# EAGLE design LB_BIT_i22_sequencer-v03(rev2_3) (EAGLE 6.6.0)
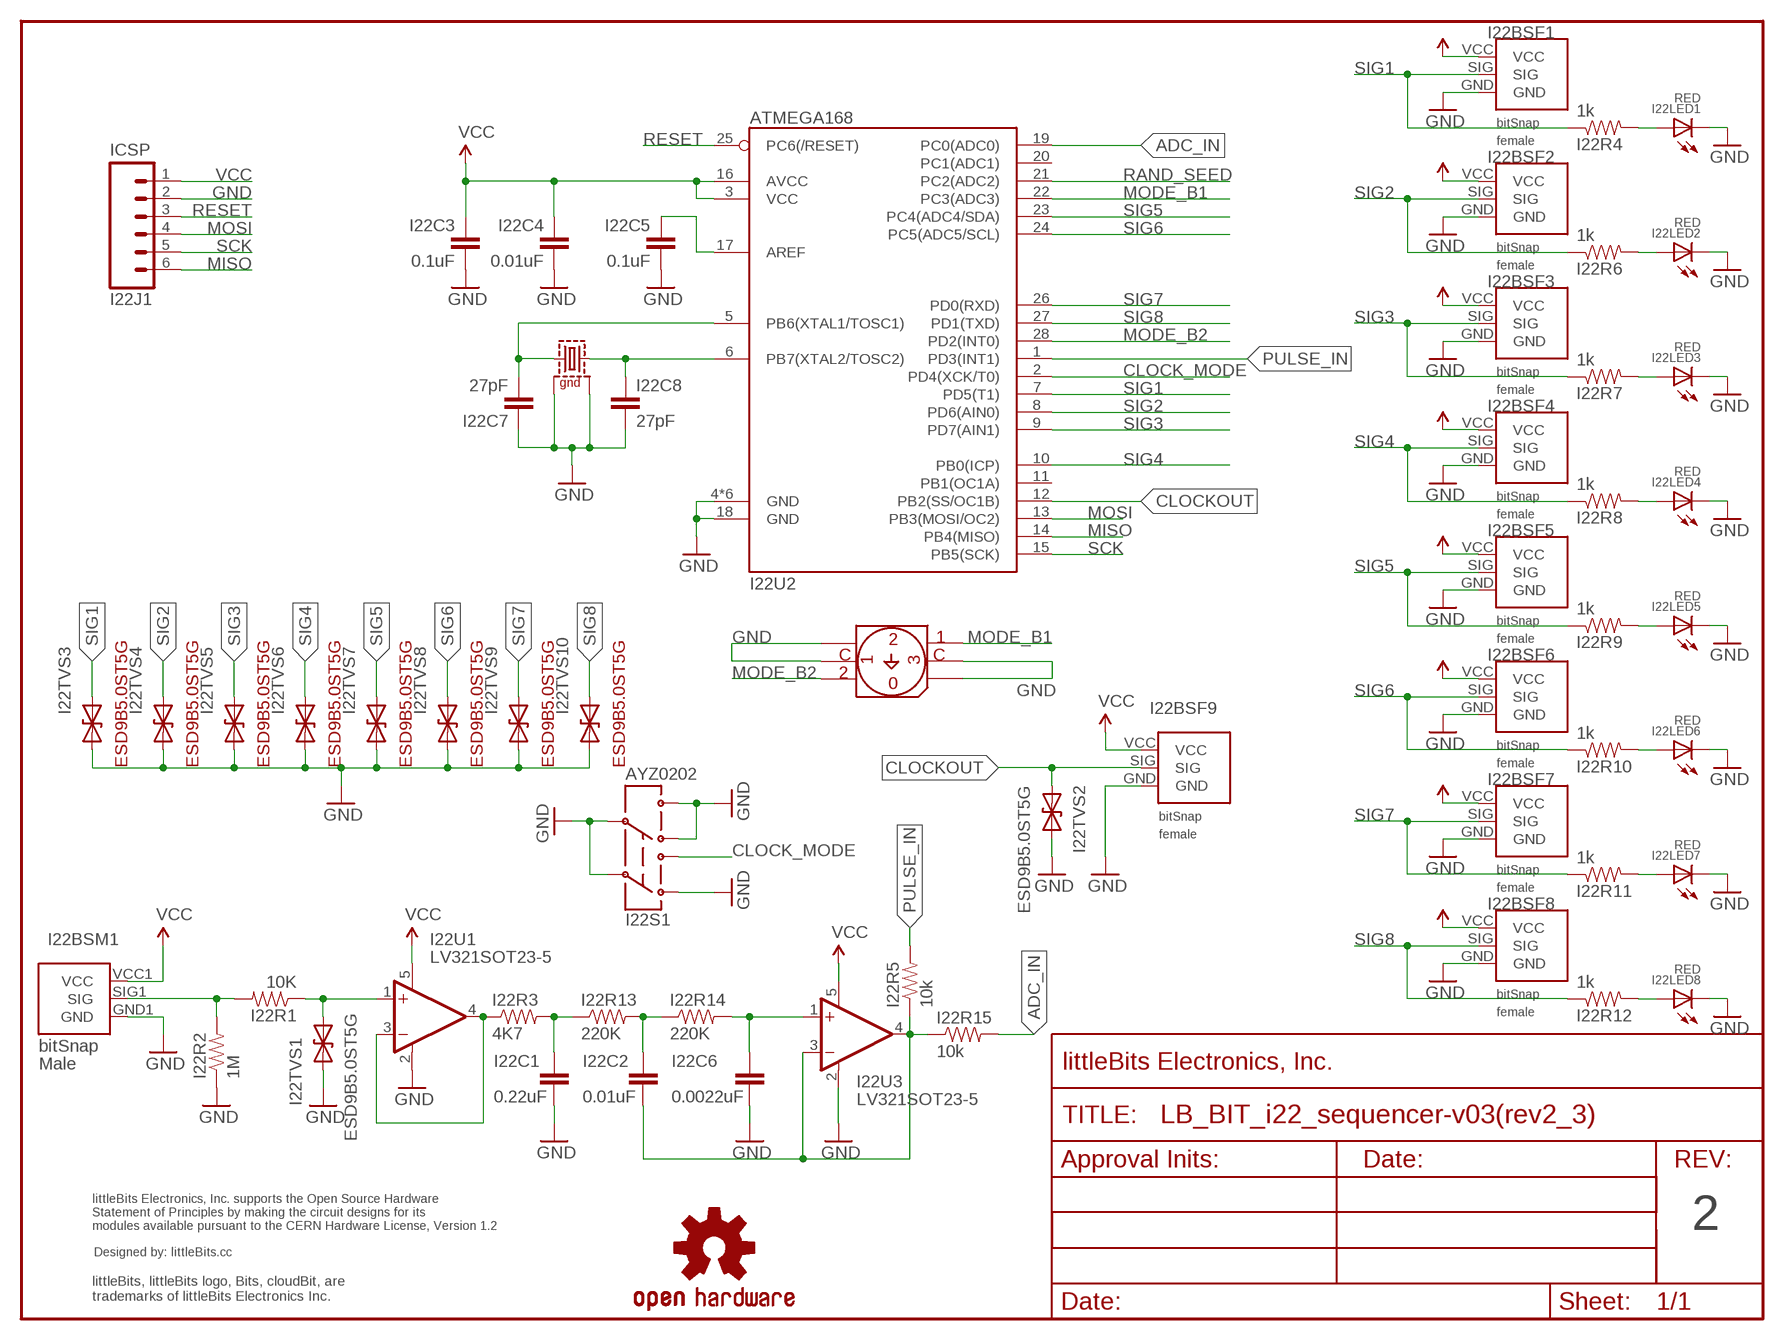
[diagram p0: schematic, sheet 1]

## Parts
I22BSF1  BITSNAP_V03_FEMALE  [BITSNAP_V03_FEMALE]
I22BSF2  BITSNAP_V03_FEMALE  [BITSNAP_V03_FEMALE]
I22BSF3  BITSNAP_V03_FEMALE  [BITSNAP_V03_FEMALE]
I22BSF4  BITSNAP_V03_FEMALE  [BITSNAP_V03_FEMALE]
I22BSF5  BITSNAP_V03_FEMALE  [BITSNAP_V03_FEMALE]
I22BSF6  BITSNAP_V03_FEMALE  [BITSNAP_V03_FEMALE]
I22BSF7  BITSNAP_V03_FEMALE  [BITSNAP_V03_FEMALE]
I22BSF8  BITSNAP_V03_FEMALE  [BITSNAP_V03_FEMALE]
I22BSF9  BITSNAP_V03_FEMALE  [BITSNAP_V03_FEMALE]
I22BSM1  BITSNAP_V03_MALE  [BITSNAP_V03_MALE]
I22C1  0.22uF  CAPCAP-0603  [CAP-0603]
I22C2  0.01uF  CAPCAP-0603  [CAP-0603]
I22C3  0.1uF  CAPCAP-0603  [CAP-0603]
I22C4  0.01uF  CAPCAP-0603  [CAP-0603]
I22C5  0.1uF  CAPCAP-0603  [CAP-0603]
I22C6  0.0022uF  CAPCAP-0603  [CAP-0603]
I22C7  27pF  CAPCAP-0603  [CAP-0603]
I22C8  27pF  CAPCAP-0603  [CAP-0603]
I22J1  ICSP  HRD-60.1INCH_NO_SILKSCREEN  [SIP6-SM-0.1IN-NOS.S.]
I22LED1  RED  LED1206  [LED-1206]
I22LED2  RED  LED1206  [LED-1206]
I22LED3  RED  LED1206  [LED-1206]
I22LED4  RED  LED1206  [LED-1206]
I22LED5  RED  LED1206  [LED-1206]
I22LED6  RED  LED1206  [LED-1206]
I22LED7  RED  LED1206  [LED-1206]
I22LED8  RED  LED1206  [LED-1206]
I22Q1  8MHz  CRYSTAL-SMD-7B-SERIES-TXC  [CRYSTAL-SMD-7B-SERIES-5X3.2MM]
I22R1  10K  RESISTOR0603  [RES-0603]
I22R2  1M  RESISTOR0603  [RES-0603]
I22R3  4K7  RESISTOR0603  [RES-0603]
I22R4  1k  RESISTOR0603  [RES-0603]
I22R5  10k  RESISTOR0603  [RES-0603]
I22R6  1k  RESISTOR0603  [RES-0603]
I22R7  1k  RESISTOR0603  [RES-0603]
I22R8  1k  RESISTOR0603  [RES-0603]
I22R9  1k  RESISTOR0603  [RES-0603]
I22R10  1k  RESISTOR0603  [RES-0603]
I22R11  1k  RESISTOR0603  [RES-0603]
I22R12  1k  RESISTOR0603  [RES-0603]
I22R13  220K  RESISTOR0603  [RES-0603]
I22R14  220K  RESISTOR0603  [RES-0603]
I22R15  10k  RESISTOR0603  [RES-0603]
I22S1  AYZ0202  [AYZ0202]
I22S2  TER-04S  [TER-04S]
I22TVS1  ESD9B5.0ST5G  DIODE-TVSSOD-923  [SOD-923]
I22TVS2  ESD9B5.0ST5G  DIODE-TVSSOD-923  [SOD-923]
I22TVS3  DIODE-TVSSOD-923  [SOD-923]
I22TVS4  DIODE-TVSSOD-923  [SOD-923]
I22TVS5  DIODE-TVSSOD-923  [SOD-923]
I22TVS6  DIODE-TVSSOD-923  [SOD-923]
I22TVS7  DIODE-TVSSOD-923  [SOD-923]
I22TVS8  DIODE-TVSSOD-923  [SOD-923]
I22TVS9  DIODE-TVSSOD-923  [SOD-923]
I22TVS10  DIODE-TVSSOD-923  [SOD-923]
I22U1  LV321SOT23-5  [SOT23-5]
I22U2  ATMEGA168  ATMEGA168-28PINVFQFN-28  [VQFN28]
I22U3  LV321SOT23-5  [SOT23-5]
U$11  OSHW-LOGOL  [OSHW-LOGO-L]
U$14  FRAME-LETTER-OHWOHW  [FABDWG01-OHW]
U$15  OSHWCREDIT  [OSHWCREDIT]

## Nets
ADC_IN: I22R15.2 I22U2.19(PC0(ADC0))
CLOCK_MODE: I22S1.3 I22U2.2(PD4(XCK/T0))
CLOCKOUT: I22BSF9.SIG I22TVS2.1(A) I22U2.12(PB2(SS/OC1B))
GND: I22BSF1.GND I22BSF2.GND I22BSF3.GND I22BSF4.GND I22BSF5.GND I22BSF6.GND I22BSF7.GND I22BSF8.GND I22BSF9.GND I22BSM1.GND1(GND) I22C1.2 I22C3.2 I22C4.2 I22C5.2 I22C6.2 I22C7.1 I22C8.2 I22J1.2 I22LED1.C I22LED2.C I22LED3.C I22LED4.C I22LED5.C I22LED6.C I22LED7.C I22LED8.C I22Q1.P$2 I22Q1.P$4 I22R2.1 I22S1.1 I22S1.2 I22S1.4 I22S1.5 I22S1.6 I22S2.P1 I22S2.P2 I22S2.P4 I22S2.P5 I22TVS1.1(A) I22TVS2.2(C) I22TVS3.1(A) I22TVS4.1(A) I22TVS5.1(A) I22TVS6.1(A) I22TVS7.1(A) I22TVS8.1(A) I22TVS9.1(A) I22TVS10.1(A) I22U1.2(V-) I22U2.4(GND) I22U2.18(GND) I22U2.TH(GND) I22U2.TH@1(GND) I22U2.TH@2(GND) I22U2.TH@3(GND) I22U2.TH@4(GND) I22U3.2(V-)
MISO: I22J1.6 I22U2.14(PB4(MISO))
MODE_B1: I22S2.P6 I22U2.22(PC3(ADC3))
MODE_B2: I22S2.P3 I22U2.28(PD2(INT0))
MOSI: I22J1.4 I22U2.13(PB3(MOSI/OC2))
N$1: I22C5.1 I22U2.17(AREF)
N$2: I22C7.2 I22Q1.P$1 I22U2.5(PB6(XTAL1/TOSC1))
N$3: I22C2.2 I22R5.1 I22R15.1 I22U3.3(-IN) I22U3.4(OUT)
N$4: I22R3.1 I22U1.3(-IN) I22U1.4(OUT)
N$5: I22C2.1 I22R13.2 I22R14.1
N$6: I22C8.1 I22Q1.P$3 I22U2.6(PB7(XTAL2/TOSC2))
N$7: I22C6.1 I22R14.2 I22U3.1(+IN)
N$8: I22C1.1 I22R3.2 I22R13.1
N$14: I22LED1.A I22R4.2
N$17: I22LED2.A I22R6.2
N$19: I22LED3.A I22R7.2
N$21: I22LED4.A I22R8.2
N$23: I22LED5.A I22R9.2
N$25: I22LED6.A I22R10.2
N$27: I22LED7.A I22R11.2
N$29: I22LED8.A I22R12.2
N$34: I22R1.1 I22TVS1.2(C) I22U1.1(+IN)
PULSE_IN: I22R5.2 I22U2.1(PD3(INT1))
RAND_SEED: I22U2.21(PC2(ADC2))
RESET: I22J1.3 I22U2.25(PC6(/RESET))
SCK: I22J1.5 I22U2.15(PB5(SCK))
SIG: I22BSM1.SIG1(SIG) I22R1.2 I22R2.2
SIG1: I22BSF1.SIG I22R4.1 I22TVS3.2(C) I22U2.7(PD5(T1))
SIG2: I22BSF2.SIG I22R6.1 I22TVS4.2(C) I22U2.8(PD6(AIN0))
SIG3: I22BSF3.SIG I22R7.1 I22TVS5.2(C) I22U2.9(PD7(AIN1))
SIG4: I22BSF4.SIG I22R8.1 I22TVS6.2(C) I22U2.10(PB0(ICP))
SIG5: I22BSF5.SIG I22R9.1 I22TVS7.2(C) I22U2.23(PC4(ADC4/SDA))
SIG6: I22BSF6.SIG I22R10.1 I22TVS8.2(C) I22U2.24(PC5(ADC5/SCL))
SIG7: I22BSF7.SIG I22R11.1 I22TVS9.2(C) I22U2.26(PD0(RXD))
SIG8: I22BSF8.SIG I22R12.1 I22TVS10.2(C) I22U2.27(PD1(TXD))
VCC: I22BSF1.VCC I22BSF2.VCC I22BSF3.VCC I22BSF4.VCC I22BSF5.VCC I22BSF6.VCC I22BSF7.VCC I22BSF8.VCC I22BSF9.VCC I22BSM1.VCC1(VCC) I22C3.1 I22C4.1 I22J1.1 I22U1.5(V+) I22U2.3(VCC) I22U2.16(AVCC) I22U3.5(V+)
Unconnected: I22U2.11(PB1(OC1A)) I22U2.20(PC1(ADC1))

## Notes on the sheet
- 2

## Library data of the parts
I22BSF1-I22BSF9 = bitSnap:BITSNAP_V03_FEMALE
I22BSM1 = bitSnap:BITSNAP_V03_MALE
I22C1-I22C8 = LITTLEBITS:CAP
I22J1 = LITTLEBITS:HRD-6
I22LED1-I22LED8 = LITTLEBITS:LED
I22Q1 = LITTLEBITS:CRYSTAL-SMD-7B-SERIES-TXC; MFG: TXC; MPN: 7B SERIES
I22R1-I22R15 = LITTLEBITS:RESISTOR
I22S1 = LITTLEBITS:AYZ0202
I22S2 = LITTLEBITS:TER-04S: SUNGMUN ELECTRONICS 4-position rotary DIP switch Model No: TER-04S; MFG: Sung Mun Electronics Co.; MPN: TER-04S
I22TVS1-I22TVS10 = LITTLEBITS:DIODE-TVS: Bidirectional Transient Voltage Suppression Diode: Device conducts in avalanche mode after reaching a part dependent voltage threshold. Used for limiting voltage spikes on ESD sensitive inputs and outputs.; IEC_ESD_PROT0: +/-18kV; LB_PN: ?; MPN: ESD9B5.0ST5G; V_CLAMP: ?; V_OPERATION: 5V
I22U1 I22U3 = LITTLEBITS:LV321
I22U2 = LITTLEBITS:ATMEGA168-28PIN
U$11 = LITTLEBITS:OSHW-LOGO: Open Source Hardware Logo This logo indicates the piece of hardware it is found on incorporates a OSHW license and/or adheres to the definition of open source hardware found here: http://freedomdefined.org/OSHW
U$14 = LITTLEBITS:FRAME-LETTER-OHW
U$15 = LITTLEBITS:OSHWCREDIT

## Board
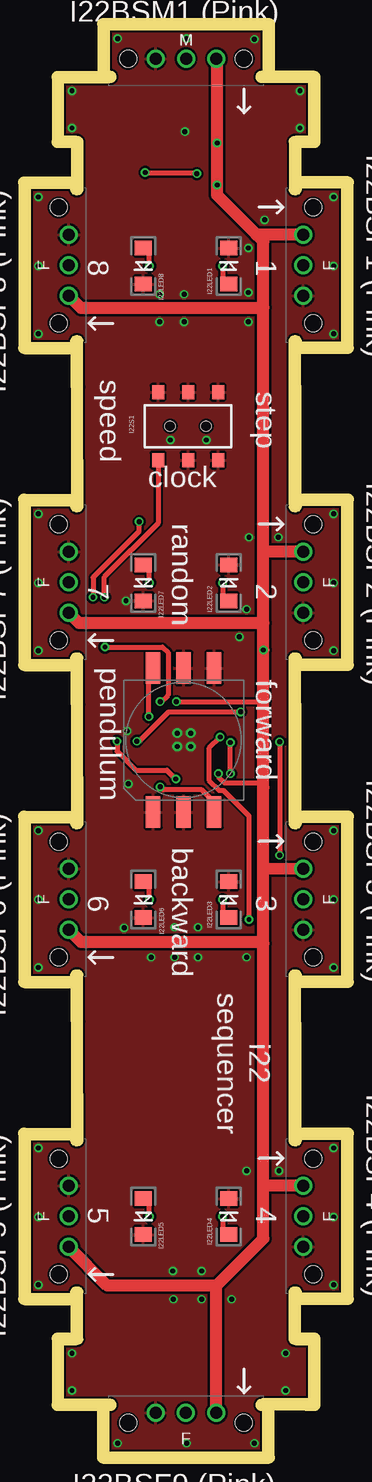
[diagram p1: board, top side]
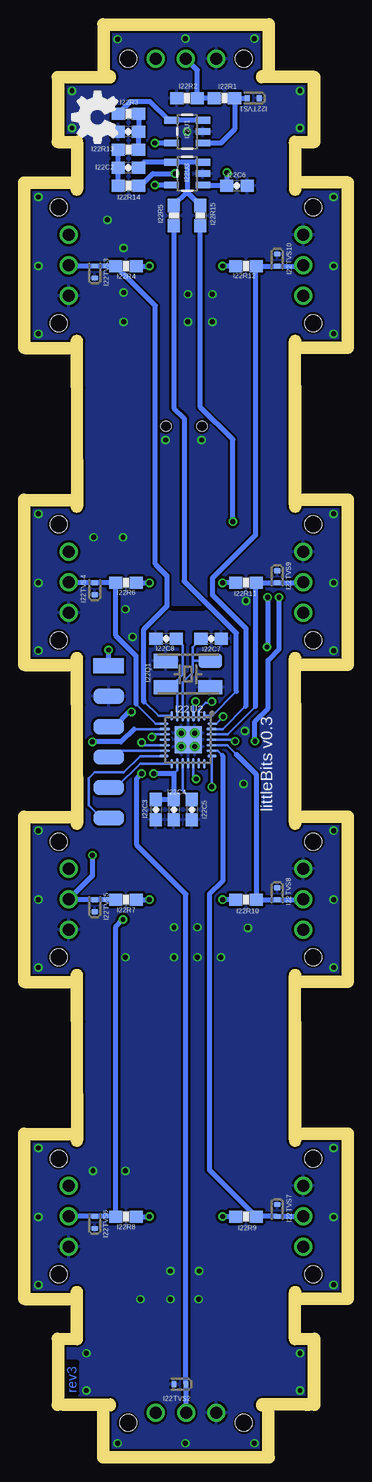
[diagram p2: board, bottom side, seen from below]

Size 26 x 118.47 mm. Coordinates in mm from the lower left corner, seen from the top.
Outline: 2.8,4.4 2.8,8.91 3.9,8.91 arc90 4.4,9.41 4.4,9.42
Outline: 23.2,4.4 23.2,8.91 22.1,8.91 arc-90 21.6,9.41 21.6,9.42
Outline: 23.2,114.07 23.2,109.63 22.1,109.63 arc90 21.6,109.13 21.6,109.06
Outline: 2.8,114.07 2.8,109.63 3.9,109.63 arc-90 4.4,109.13 4.4,109.05
Outline: 4.4,26 4.4,39.66
Outline: 4.4,52.46 4.4,66.12
Outline: 4.4,78.92 4.4,88.75
Outline: 21.6,26 21.6,39.66
Outline: 21.6,52.46 21.6,66.12
Outline: 21.6,78.92 21.6,92.58
Copper layers (1*16): Top 0.035mm / dielectric 1.5mm / Bottom 0.035mm
Design rules "littleBitsDRC": minimum track width 0.2mm, minimum drill 0.4mm, track to track 0.2mm, track to pad 0.2mm, pad to pad 0.2mm, via to via 0.2mm, smd to smd 0mil, copper to edge 0.2mm, drill to drill 0.2mm, minimum pad ring 0.2mm, minimum via ring 0.15mm, stop-mask expansion 0.1mm, vias tented up to drill 0mil, thermal gap 0.2mm
bRestrict: 1 lines
Milling: 18 lines

### Footprints (pad centres in the part's own frame; a part is rotated, then mirrored left to right if it is on the bottom)
BITSNAP_V03_FEMALE = drill 1: GND 3.86,3.23; SIG 6.4,3.23; VCC 8.94,3.23 | hole 1.4: 1.58,2.4; 11.22,2.4
BITSNAP_V03_MALE = drill 1: GND1 8.94,2.4; SIG1 6.4,2.4; VCC1 3.86,2.4 | hole 1.4: 1.58,2.4; 11.22,2.4
CAP-0603 = smd 1.1 x 1: 1 -0.85,0; 2 0.85,0
SIP6-SM-0.1IN-NOS.S. = smd 1.27 x 2.54: 1 -6.35,0; 2 -3.81,0; 3 -1.27,0; 4 1.27,0; 5 3.81,0; 6 6.35,0
LED-1206 = smd 1.2 x 1.4: A -1.5,0; C 1.5,0
CRYSTAL-SMD-7B-SERIES-5X3.2MM = smd 2 x 1.2: P$1 -1.85,-1.1; P$2 1.85,-1.1; P$3 1.85,1.1; P$4 -1.85,1.1
RES-0603 = smd 1.1 x 1: 1 -0.85,0; 2 0.85,0
AYZ0202 = smd 1 x 1.15: 1 -2.5,2.825; 2 0,2.825; 3 2.5,2.825; 4 -2.5,-2.825; 5 0,-2.825; 6 2.5,-2.825 | hole 0.85: 1.5,0; -1.5,0
TER-04S = smd 2.6 x 1.2: P1 -1,7.54; P2 -1,5; P3 -1,2.46; P4 11,2.46; P5 11,5; P6 11,7.54
SOD-923 = smd 0.4 x 0.5: 1 -0.5,0; 2 0.5,0
SOT23-5 = smd 0.55 x 1.2: 1 -0.95,-1.3; 2 0,-1.3; 3 0.95,-1.3; 4 0.95,1.3; 5 -0.95,1.3
VQFN28 = smd 0.75 x 0.2: 1 -2,1.35; 7 -2,-1.35; 15 2,-1.35; 21 2,1.35 | smd 0.85 x 0.2: 2 -1.95,0.9; 3 -1.95,0.455; 4 -1.95,0; 5 -1.95,-0.45; 6 -1.95,-0.9; 16 1.95,-0.9; 17 1.95,-0.45; 18 1.95,0; 19 1.95,0.45; 20 1.95,0.9 | smd 0.2 x 0.75: 8 -1.35,-2; 14 1.35,-2; 22 1.35,2; 28 -1.35,2 | smd 0.2 x 0.85: 9 -0.9,-1.95; 10 -0.45,-1.95; 11 0,-1.95; 12 0.45,-1.95; 13 0.9,-1.95; 23 0.9,1.95; 24 0.45,1.95; 25 0,1.95; 26 -0.45,1.95; 27 -0.9,1.95 | smd 2.25 x 2.25: TH 0,0 | drill 0.406 pad 0.406: TH@1 -0.559,0.559; TH@2 0.559,0.559; TH@3 -0.559,-0.559; TH@4 0.559,-0.559

### Placement (x,y rotation side)
I22BSF1  26,92.47 90 top
I22BSF2  26,66.05 90 top
I22BSF3  26,39.62 90 top
I22BSF4  26,13.2 90 top
I22BSF5  0,26.01 270 top
I22BSF6  0,52.42 270 top
I22BSF7  0,78.84 270 top
I22BSF8  0,105.27 270 top
I22BSF9  6.6,0 0 top
I22BSM1  19.4,118.47 180 top
I22C1  17.8,110 180 bottom
I22C2  17.8,107 0 bottom
I22C3  15.5,53.5 270 bottom
I22C4  14,53.5 270 bottom
I22C5  12.5,53.5 270 bottom
I22C6  8.75,105.5 0 bottom
I22C7  10.9,67.75 180 bottom
I22C8  14.65,67.75 180 bottom
I22J1  19.45,59.15 270 bottom
I22LED1  16.55,98.8 90 top
I22LED2  16.55,72.4 90 top
I22LED3  16.55,46 90 top
I22LED4  16.55,19.59 90 top
I22LED5  9.45,19.59 270 top
I22LED6  9.45,46 270 top
I22LED7  9.45,72.4 270 top
I22LED8  9.45,98.8 270 top
I22Q1  12.83,64.8 180 bottom
I22R1  9.8,112.8 180 bottom
I22R2  12.9,112.8 0 bottom
I22R3  17.8,111.5 0 bottom
I22R4  18,98.8 0 bottom
I22R5  14,103 270 bottom
I22R6  18,72.4 0 bottom
I22R7  18,46 0 bottom
I22R8  18,19.59 0 bottom
I22R9  8,19.59 180 bottom
I22R10  8,46 180 bottom
I22R11  8,72.4 180 bottom
I22R12  8,98.8 180 bottom
I22R13  17.8,108.5 180 bottom
I22R14  17.8,105.5 0 bottom
I22R15  11.8,103 270 bottom
I22S1  13.18,85.45 180 top
I22S2  7.8,64.3 270 top
I22TVS1  7.4,112.8 180 bottom
I22TVS2  13.5,5.62 180 bottom
I22TVS3  20.6,98.3 90 bottom
I22TVS4  20.6,71.9 90 bottom
I22TVS5  20.6,45.5 90 bottom
I22TVS6  20.6,19.1 90 bottom
I22TVS7  5.4,20.1 270 bottom
I22TVS8  5.4,46.5 270 bottom
I22TVS9  5.4,72.9 270 bottom
I22TVS10  5.4,99.3 270 bottom
I22U1  12.9,110 90 bottom
I22U2  12.83,59.32 270 bottom
I22U3  12.9,106.5 90 bottom
U$11  122.95,47.3 0 top  (outside the outline)
U$12  [OSHW_FILLX150_NOTEXT]  18.7,108.25 0 top
U$14  64.8,66.35 0 top  (outside the outline)
U$15  48.8,43.35 0 top  (outside the outline)

### Tracks (layer width: path | path; a pad name or v marks a point on that pad's centre or on a via)
ADC_IN  (via drill 0.41)
  Top 0.406: v12.15,56.05 11.4,56.8 8.8,56.8 7.25,58.35 v7.25,59.2 | v5.25,71.2 5.25,72.85 9.1,76.7 v9.1,77.5
  Bottom 0.203: I22U2.19 12.38,56.28 v12.15,56.05
  Bottom 0.406: v5.25,71.2 5.25,66.85 6.15,65.95 6.15,61.95 7.25,60.85 v7.25,59.2 | v9.1,77.5 9.1,84.35 11.8,87.05 I22R15.2
CLOCK_MODE  (via drill 0.41)
  Top 0.406: v6.25,67.05 11.05,67.05 11.5,66.6 11.5,63.05 10.95,62.5 v10.85,62.5 | 6.15,71.2 v6.2,71.2 6.2,72.9 10.68,77.38 I22S1.3
  Bottom 0.203: I22U2.2 11.93,61.82 11.35,62.4 10.95,62.4 v10.85,62.5
  Bottom 0.406: v6.2,71.2 6.2,67.1 v6.25,67.05
CLOCKOUT  (via drill 0.41)
  Top 0.406: v16.7,56.5 v16.7,59.1
  Bottom 0.203: I22U2.12 16.52,58.87 v16.7,59.1
  Bottom 0.406: I22BSF9.SIG I22TVS2.1 13,46.45 17.1,50.55 17.1,56.1 v16.7,56.5
GND  (via drill 0.41)
  other vias: 8.2,55.65 8,70.9 0.7,51.75 0.7,40.35 25.3,51.75 25.3,40.35 25.3,46 0.7,46 0.7,78.15 0.7,66.75 0.7,72.4 25.3,78.15 25.3,66.75 25.3,72.4 0.7,104.55 0.7,93.15 0.7,98.8 25.3,104.55 25.3,93.15 25.3,98.8 7.3,117.75 18.7,117.7 13.05,117.75 0.7,25.3 0.7,13.9 0.7,19.55 25.3,25.3 25.3,13.9 25.3,19.55 7.3,0.7 18.7,0.7 13.05,0.7 3.5,113.4 3.5,110.3 22.5,113.4 22.5,110.3 3.5,8.2 3.5,5.1 14.3,12.7 16.8,12.7 14.3,15.05 18.05,41.2 18.05,70.2 17.45,67.9 20.7,76.2 18.25,76.2 18.2,100.3 19.55,102.65 18.2,96.6 11.7,84.3 14.7,84.3 12.9,110 8.1,60.05 18.2,94.15 20.75,23.4 18.05,23.4 21.3,8.2 21.3,5.1 14,41.2 12.05,41.2 10.1,41.2 7.85,43.65 12.05,43.7 14,43.7 11.95,12.7 11.9,15.05 12.85,94.15 12.85,96.45 10.8,96.45 10.8,94.15
  pour Bottom: 27,118.65 -1.5,118.4 -1.3,-0.55 27.35,-0.35
  pour Top: 27,118.5 -1.45,118.25 -1.1,-0.5 27.55,-0.35
  pour Top (no thermals): 11.75,60.4 11.75,58.25 13.95,58.25 13.95,60.4
MISO
  Bottom 0.203: I22U2.14 16.83,57.97 18.2,56.6 20.6,56.6 21.1,56.1 21.1,53.85 20.05,52.8 I22J1.6
MODE_B1  (via drill 0.41)
  Top 0.406: I22S2.P6 15.34,54.11 14.3,55.15 11.1,55.15 v10.85,55.4
  Bottom 0.203: I22U2.22 10.85,57.95 v10.85,55.4
MODE_B2  (via drill 0.41)
  Top 0.203: 9.9,64.94 I22S2.P3
  Top 0.406: v9.9,61.25 9.9,64.94
  Bottom 0.203: I22U2.28 10.48,60.67 v9.9,61.25
MOSI
  Bottom 0.203: I22U2.13 18.91,58.42 I22J1.4
N$1
  Bottom 0.203: I22U2.17 13.28,55.13 I22C5.1
N$2
  Bottom 0.203: I22U2.5 13.28,64.12 12.45,64.95 12.45,65.9 | 12.45,65.9 12.45,67.05 I22C7.2 | I22Q1.P$1 12.45,65.9
N$3
  Bottom 0.406: I22C2.2 16.5,107.45 I22U3.4 12.8,107.45 | I22U3.3 12.8,107.45 | 12.8,107.45 12.9,107.35 12.9,104.95 | 12.9,104.95 I22R15.1 | 12.9,104.95 I22R5.1
N$4
  Bottom 0.406: I22U1.3 I22U1.4 14.45,110.95 16,112.5 17.65,112.5 I22R3.1
N$5
  Bottom 0.406: I22R13.2 I22C2.1 I22R14.1
N$6
  Bottom 0.203: I22Q1.P$3 13.9,63.7 13.8,63.8 13.8,64.2 13.73,64.27 | I22U2.6 13.73,64.27 | 13.73,64.27 13.25,64.75 13.25,67.2 I22C8.1
N$7  (via drill 0.41)
  Top 0.406: v13.9,106.5 13.85,106.55 9.75,106.55 v9.6,106.6
  Bottom 0.406: I22U3.1 9.7,105.55 I22C6.1 v9.6,106.6 | I22R14.2 16.75,105.5 15.75,106.5 v13.9,106.5
N$8
  Bottom 0.406: I22R3.2 I22C1.1 I22R13.1
N$14  (via drill 0.41)
  Top 0.406: v16.05,98.8 16.05,97.7 I22LED1.A
  Bottom 0.406: I22R4.2 v16.05,98.8
N$17  (via drill 0.41)
  Top 0.406: v16.05,72.4 16.05,71.35 I22LED2.A
  Bottom 0.406: I22R6.2 v16.05,72.4
N$19  (via drill 0.41)
  Top 0.406: v16.05,46 16.05,44.95 I22LED3.A
  Bottom 0.406: I22R7.2 v16.05,46
N$21  (via drill 0.41)
  Top 0.406: v16.05,19.6 16.05,18.64 I22LED4.A
  Bottom 0.406: I22R8.2 16.11,19.59 v16.05,19.6
N$23  (via drill 0.41)
  Top 0.406: v9.95,19.6 9.95,20.59 I22LED5.A
  Bottom 0.406: I22R9.2 9.74,19.59 v9.95,19.6
N$25  (via drill 0.41)
  Top 0.406: v9.95,46 9.95,47.1 I22LED6.A
  Bottom 0.406: I22R10.2 v9.95,46
N$27  (via drill 0.41)
  Top 0.406: v9.95,72.4 9.95,73.4 I22LED7.A
  Bottom 0.406: I22R11.2 v9.95,72.4
N$29  (via drill 0.41)
  Top 0.406: v9.95,98.8 9.95,99.85 I22LED8.A
  Bottom 0.406: I22R12.2 v9.95,98.8
N$34
  Bottom 0.406: 11.55,109 I22U1.1 10.1,109.05 8.95,110.2 I22R1.1 I22TVS1.2
PULSE_IN
  Bottom 0.203: I22U2.1 10.83,61.32 8.8,63.35
  Bottom 0.406: 8.8,63.35 8.8,68.2 13.15,72.55 13.15,86.1 14,86.95 I22R5.2
RESET  (via drill 0.41)
  Top 0.406: v17.55,61.65 11.55,61.65 9.1,59.2 v8.9,59.2
  Bottom 0.203: 18.9,60.5 19.37,60.5 I22J1.3 | I22U2.25 9.02,59.32 v8.9,59.2
  Bottom 0.406: v17.55,61.65 17.75,61.65 18.9,60.5
SCK
  Bottom 0.203: I22U2.15 16.83,57.32 18.8,55.35 I22J1.5
SIG
  Bottom 0.406: I22BSM1.SIG1 12.05,115.12 I22R2.2 I22R1.2
SIG1
  Bottom 0.203: 16.5,62.55 15.27,61.32 I22U2.7
  Bottom 0.406: 16.5,62.45 16.5,62.55 16.5,68.55 14.6,70.45 14.6,73 15.55,73.95 15.55,95.5 I22R4.1 I22TVS3.2 22.7,98.8 I22BSF1.SIG
SIG2
  Bottom 0.203: 17.15,62.3 15.52,60.67 I22U2.8
  Bottom 0.406: 17.15,62.3 17.15,66.3 18.85,68 I22R6.1 I22TVS4.2 22.72,72.4 I22BSF2.SIG
SIG3  (via drill 0.41)
  Top 0.406: v20.8,59.15 v20.8,49.7
  Bottom 0.203: I22U2.9 17.33,60.22
  Bottom 0.406: 17.33,60.22 18.4,59.15 v20.8,59.15 | I22R7.1 I22TVS5.2 22.74,46 I22BSF3.SIG 20.8,48 v20.8,49.7
SIG4  (via drill 0.41)
  Top 0.406: v18.25,44.35 18.25,52.95 16.1,55.1 15.75,55.1 14.9,55.95 14.9,58.6 v15.85,59.55
  Bottom 0.203: I22U2.10 15.63,59.77 v15.85,59.55
  Bottom 0.406: v18.25,44.35 18.85,43.75 I22R8.1 I22TVS6.2 I22BSF4.SIG
SIG5
  Bottom 0.203: I22U2.23 10.37,58.42 9.95,58
  Bottom 0.406: I22R9.1 | I22R9.1 11.05,23.49 11.05,46.45 9.95,47.55 9.95,58 | I22BSF5.SIG I22TVS7.2 I22R9.1
SIG6
  Bottom 0.203: 8.8,58.1 9.57,58.87 I22U2.24
  Bottom 0.406: 8.8,58.1 7.15,56.45 I22R10.1 I22TVS8.2 3.25,46 I22BSF6.SIG
SIG7
  Bottom 0.203: 7.2,62.1 9.53,59.77 I22U2.26
  Bottom 0.406: 7.2,62.1 7.2,72.35 I22R11.1 I22TVS9.2 3.27,72.4 I22BSF7.SIG
SIG8
  Bottom 0.203: I22U2.27 9.93,60.22 8.05,62.1
  Bottom 0.406: 8.05,62.1 8,62.15 8,68.6 10.8,71.4 10.8,72.8 7.2,76.4 7.2,98.75 I22R12.1 I22TVS10.2 3.29,98.8 I22BSF8.SIG
VCC  (via drill 0.41)
  Top 0.203: 19.3,62.5 19.45,62.6 | 19.1,55.7 19.45,55.35
  Top 0.406: 19.4,50.9 19.45,50.95 | v12.2,62.5 19.3,62.5 | 19.1,55.7 16.25,55.7 15.7,56.25 v15.7,56.5
  Top 1: 19.45,22.3 19.45,17.75 15.54,13.84 | 19.45,22.3 19.45,42.35 | 19.45,42.35 19.45,48.65 | 19.45,48.65 19.45,50.95 19.45,55.35 19.45,62.6 v19.45,66.8 19.45,69.05 | 19.45,69.05 19.45,74.95 | 19.45,74.95 19.45,95.35 | 19.45,95.35 19.45,100.85 18.89,101.41 | 18.89,101.41 15.6,104.7 v15.6,105.55 v15.6,109.05 15.6,115.79 I22BSM1.VCC1 | I22BSF4.VCC 19.61,22.14 19.45,22.3 | I22BSF3.VCC 19.56,48.54 19.45,48.65 | 19.45,42.35 19.35,42.45 4.27,42.45 I22BSF6.VCC | 19.45,95.35 19.4,95.3 4.25,95.3 I22BSF8.VCC | I22BSF9.VCC 15.54,13.84 | 15.54,13.84 6.45,13.84 I22BSF5.VCC | 19.45,69.05 4.08,69.05 I22BSF7.VCC | I22BSF1.VCC 18.89,101.41 | I22BSF2.VCC 19.48,74.98 19.45,74.95
  Bottom 0.203: I22U2.3 12.38,62.33 v12.2,62.5 | 13.73,54.62 I22C4.1 | I22U2.16 13.73,56.77 14,56.5
  Bottom 0.406: I22U1.5 v15.6,109.05 | I22U3.5 v15.6,105.55 | I22J1.1 v19.45,66.8 | I22C3.1 I22C4.1 14,56.5 v15.7,56.5

### Text on the board
Bottom: rev3
tPlace: 8 | 1 | speed | step | clock | random | 7 | 2 | pendulum | forward | backward | 6 | 3 | i22 / sequencer | 5 | 4
bPlace: littleBits v0.3
tNames: I22BSM1 (Pink) | I22BSF1 (Pink) | I22BSF8 (Pink) | I22BSF2 (Pink) | I22BSF7 (Pink) | I22BSF3 (Pink) | I22BSF6 (Pink) | I22BSF4 (Pink) | I22BSF5 (Pink) | I22BSF9 (Pink)
Milling: 1mm DIA. ROUTER PATH
dxf: 3 | i22 Sequencer bit